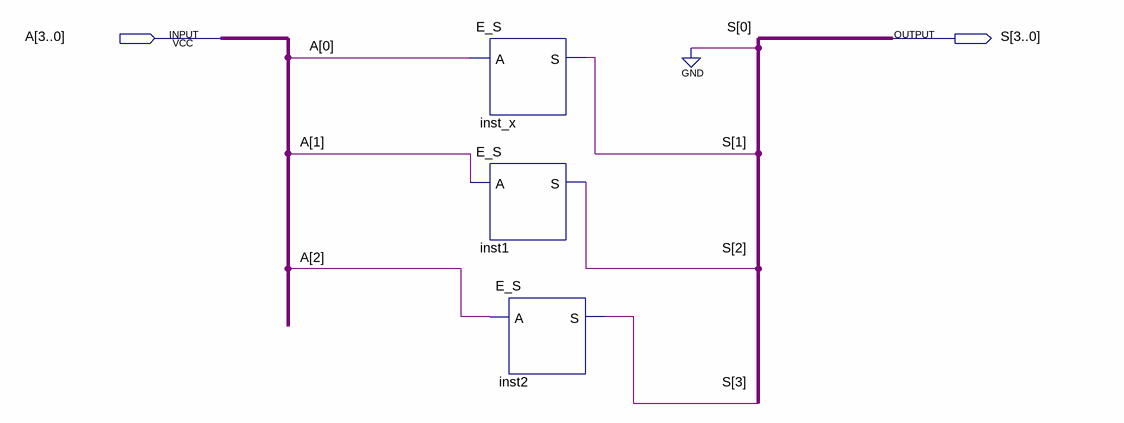
[diagram p0: schematic sheet]
// Quartus schematic Desloc_esquerda.bdf as structural Verilog: 3 symbols, 2 pins
module Desloc_esquerda (
  input  [3:0] A,
  output [3:0] S
);

  E_S inst_x (.A(A[0]), .S(S[1]));
  E_S inst1 (.A(A[1]), .S(S[2]));
  E_S inst2 (.A(A[2]), .S(S[3]));

  assign S[0] = 1'b0;
endmodule
